# Altium schematic sheet Window_Check.SchDoc
size A4; Organization: Altium Limited; Address1: L3, 12a Rodborough Rd; Address2: Frenchs Forest; Address3: NSW; Address4: Australia 2086
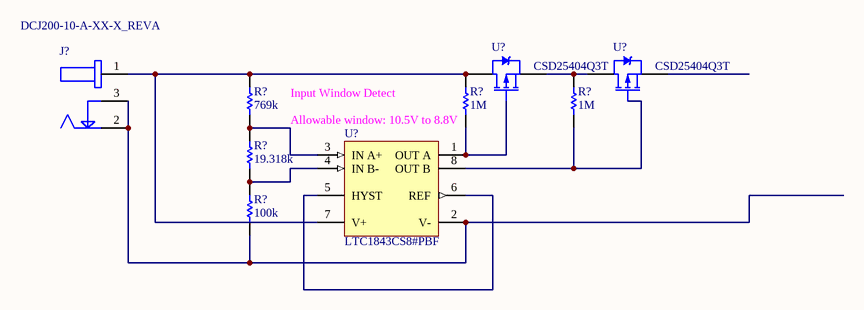
[diagram p0: Window_Check.SchDoc]

## Parts
(Parts that share a designator on the sheet are numbered #1, #2 ... from top to bottom, then left to right.)
J?  DCJ200-10-A-XX-X_REVA  [GCT_DCJ200-10-A-XX-X_REVA]
R?#1  769k  [STD_0805_R]
R?#2  1M  [STD_0805_R]
R?#3  1M  [STD_0805_R]
R?#4  19.318k  [STD_0805_R]
R?#5  100k  [STD_0805_R]
U?#1  CSD25404Q3T  [TRANS_CSD17308Q3]
U?#2  CSD25404Q3T  [TRANS_CSD17308Q3]
U?#3  LTC1843CS8#PBF  [LT-S8_N]

## Nets
NetJ?_1: J?.1 R?#1.2 R?#2.2 U?#1.1(D) U?#3.7(V+)
NetJ?_2: J?.2 J?.3 R?#5.1 U?#3.2(V-)
NetR?#1_1: R?#1.1 R?#4.2 U?#3.3(IN_A+)
NetR?#2_1: R?#2.1 U?#3.1(OUT_A)
NetR?#3_1: R?#3.1 U?#3.8(OUT_B)
NetR?#3_2: R?#3.2 U?#1.3(S) U?#2.1(D)
NetR?#4_1: R?#4.1 R?#5.2 U?#3.4(IN_B-)
NetU?#3_5: U?#3.5(HYST) U?#3.6(REF)

Not connected (* = marked no-connect by the designer): U?#2 3(S)

## Notes on the sheet
- Input Window Detect
- (near R?#2) Allowable window: 10.5V to 8.8V
- Title
- Date:
- RE:
- Arturo di Girolamo
- Size:
- A3
- A

## Library data of the parts
J? = DCJ200-10-A-XX-X_REVA: Power Barrel Connector Jack 2.05mm ID _0.081_, 5.50mm OD _0.217_ Through Hole, Right Angle; MP: DCJ200-10-A-K1-K; MF: Global Connector Technology; Package: None; Availability: Unavailable; Value: *; SnapEDA_Link: https://www.snapeda.com/parts/DCJ200-10-A-K1-K/Global%20Connector%20Technology/view-part/641259/?ref=snap; Price: None
R?#1-R?#5 = RC0805FR-071K65L: 1.65k; Value: 1.65k; MFGPN: RC0805FR-071K65L
U?#1 U?#2 = CSD25404Q3T: -20V, P ch NexFET MOSFET, single SON 3x3, 6.5mOhm 8-VSON-CLIP -55 to 150; MF: Texas Instruments; Purchase-URL: https://pricing.snapeda.com/search/part/CSD25404Q3T/?ref=eda; Package: VSON-CLIP-8 Texas Instruments; Value: *; Check_prices: https://www.snapeda.com/parts/CSD25404Q3T/Texas%20Instruments/view-part/808596/?ref=eda; SnapEDA_Link: https://www.snapeda.com/parts/CSD25404Q3T/Texas%20Instruments/view-part/808596/?ref=snap; Availability: Warning; Price: None; MP: CSD25404Q3T
U?#3 = CMP-0360-00520-2: Ultralow Power Comparator with Reference, 2 Channels, 2.5 to 11 V, 0 to +70 degC, 8-pin SOP (S8); Manufacturer: Linear Technology; Supply Current (uA) Guaranteed: 5.7; Vs Min (V): 2; Prop Delay (us): 4; Vos (mV) Typical: 3; Supply Current (uA) Typical: 3.5; Vs Max (V): 11; Vos (mV) Guaranteed: 10; ComponentLink1URL: http://www.linear.com/; ComponentLink1Description: Manufacturer URL; ComponentLink3URL: http://cds.linear.com/docs/en/packaging/05081610_G_SO8.pdf; Generic Part Number: LTC1843; Supply Voltage Range: 2.5 to 11 V; Mounting Technology: Surface Mount; PackageReference: S8; ComponentLink3Description: Package Specification; PackageDescription: 8-Pin Plastic Small Outline (Narrow .150 Inch), Body 4.9 x 3.9 mm, Pitch 1.27 mm; Features: Reference, Comparator; RoHS: Y; Channels (#): 2; ComponentLink2Description: Datasheet; ComponentLink2URL: http://cds.linear.com/docs/en/datasheet/184123f.pdf; PartNumber: LTC1843CS8#PBF